# Altium schematic sheet External Memory.SchDoc
size 431 x 279 mm; Organization: ORGANIZATION; Address1: 207; Address2: 13399 104 Ave; Address3: Surrey BC, V3T 0C9; Address4: Canada; Revision: V0.0.0; SheetNumber: 3; SheetTotal: 5; ENG_APP_DATE: --/--/--; DSN_APP_DATE: --/--/--; CHK_APP_DATE: --/--/--
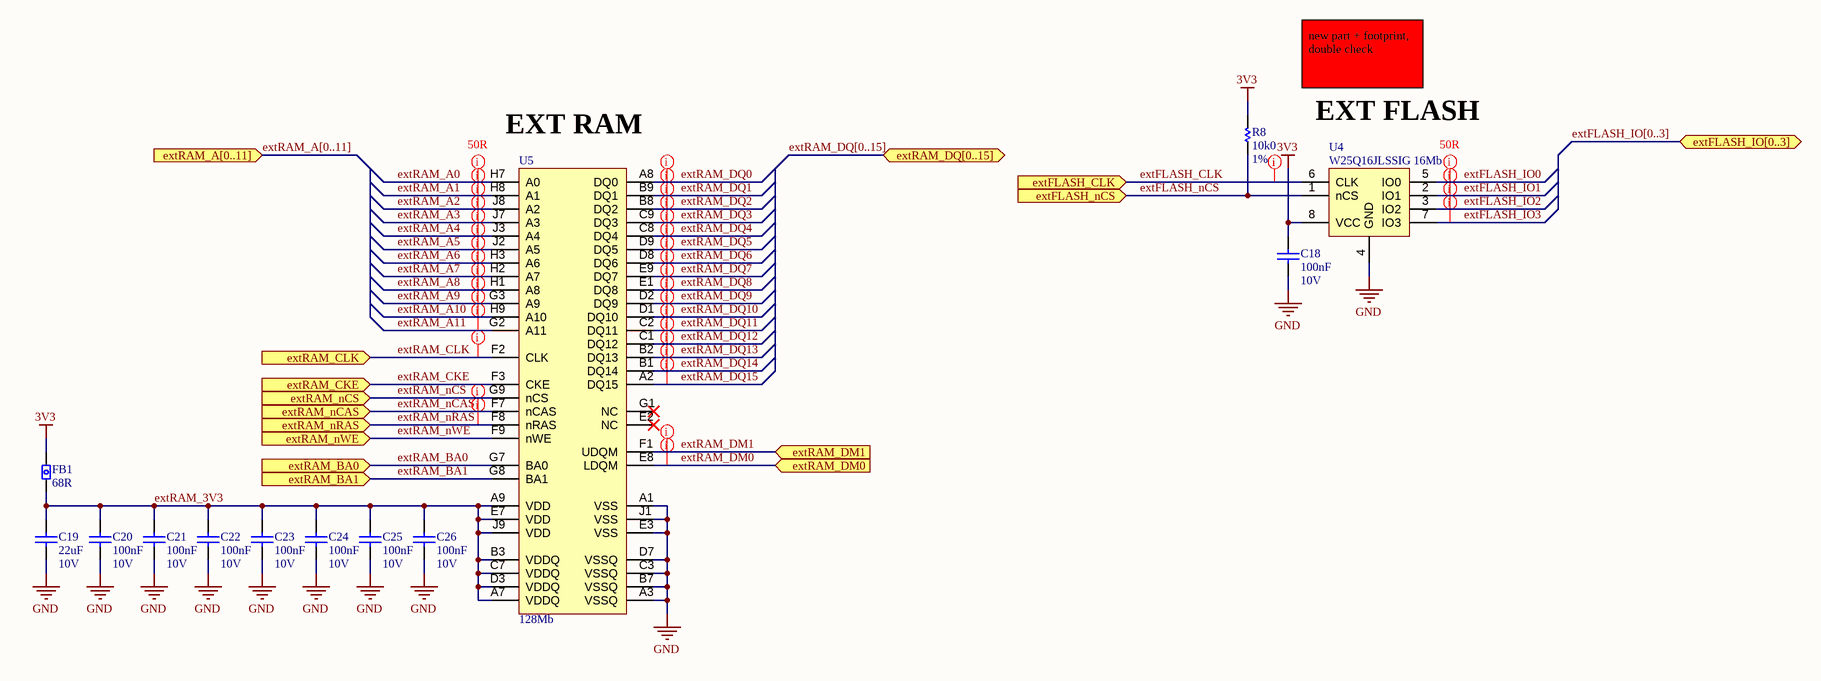
[diagram p0: External Memory.SchDoc]

## Parts
C18  100nF  Voltage Rating: 10V  [C0201]
C19  22uF  Voltage Rating: 10V  [c0603]
C20  100nF  Voltage Rating: 10V  [C0201]
C21  100nF  Voltage Rating: 10V  [C0201]
C22  100nF  Voltage Rating: 10V  [C0201]
C23  100nF  Voltage Rating: 10V  [C0201]
C24  100nF  Voltage Rating: 10V  [C0201]
C25  100nF  Voltage Rating: 10V  [C0201]
C26  100nF  Voltage Rating: 10V  [C0201]
FB1  68R  [FB0402]
R8  10k0  Tolerance: 1%  [r0402]
U4  W25Q16JLSSIG 16Mb  [SOC8W 7.9x5.3mm]
U5  128Mb  [TFBGA54 8x8 SDRAM]

## Ports
extFLASH_CLK (in), extFLASH_IO[0..3] (bidir), extFLASH_nCS (in), extRAM_A[0..11] (in), extRAM_BA0 (in), extRAM_BA1 (in), extRAM_CKE (in), extRAM_CLK (in), extRAM_DM0 (in), extRAM_DM1 (in), extRAM_DQ[0..15] (bidir), extRAM_nCAS (in), extRAM_nCS (in), extRAM_nRAS (in), extRAM_nWE (in)

## Nets
3V3: C18.2 FB1.2 R8.2 U4.8(VCC)
GND: C18.1 C19.1 C20.1 C21.1 C22.1 C23.1 C24.1 C25.1 C26.1 U4.4(GND) U5.A1(VSS) U5.A3(VSSQ) U5.B7(VSSQ) U5.C3(VSSQ) U5.D7(VSSQ) U5.E3(VSS) U5.J1(VSS)
extFLASH_CLK: U4.6(CLK) ; port extFLASH_CLK
extFLASH_IO0: U4.5(IO0)
extFLASH_IO1: U4.2(IO1)
extFLASH_IO2: U4.3(IO2)
extFLASH_IO3: U4.7(IO3)
extFLASH_nCS: R8.1 U4.1(nCS) ; port extFLASH_nCS
extRAM_3V3: C19.2 C20.2 C21.2 C22.2 C23.2 C24.2 C25.2 C26.2 FB1.1 U5.A7(VDDQ) U5.A9(VDD) U5.B3(VDDQ) U5.C7(VDDQ) U5.D3(VDDQ) U5.E7(VDD) U5.J9(VDD)
extRAM_A0: U5.H7(A0)
extRAM_A1: U5.H8(A1)
extRAM_A2: U5.J8(A2)
extRAM_A3: U5.J7(A3)
extRAM_A4: U5.J3(A4)
extRAM_A5: U5.J2(A5)
extRAM_A6: U5.H3(A6)
extRAM_A7: U5.H2(A7)
extRAM_A8: U5.H1(A8)
extRAM_A9: U5.G3(A9)
extRAM_A10: U5.H9(A10)
extRAM_A11: U5.G2(A11)
extRAM_BA0: U5.G7(BA0) ; port extRAM_BA0
extRAM_BA1: U5.G8(BA1) ; port extRAM_BA1
extRAM_CKE: U5.F3(CKE) ; port extRAM_CKE
extRAM_CLK: U5.F2(CLK) ; port extRAM_CLK
extRAM_DM0: U5.E8(LDQM) ; port extRAM_DM0
extRAM_DM1: U5.F1(UDQM) ; port extRAM_DM1
extRAM_DQ0: U5.A8(DQ0)
extRAM_DQ1: U5.B9(DQ1)
extRAM_DQ2: U5.B8(DQ2)
extRAM_DQ3: U5.C9(DQ3)
extRAM_DQ4: U5.C8(DQ4)
extRAM_DQ5: U5.D9(DQ5)
extRAM_DQ6: U5.D8(DQ6)
extRAM_DQ7: U5.E9(DQ7)
extRAM_DQ8: U5.E1(DQ8)
extRAM_DQ9: U5.D2(DQ9)
extRAM_DQ10: U5.D1(DQ10)
extRAM_DQ11: U5.C2(DQ11)
extRAM_DQ12: U5.C1(DQ12)
extRAM_DQ13: U5.B2(DQ13)
extRAM_DQ14: U5.B1(DQ14)
extRAM_DQ15: U5.A2(DQ15)
extRAM_nCAS: U5.F7(nCAS) ; port extRAM_nCAS
extRAM_nCS: U5.G9(nCS) ; port extRAM_nCS
extRAM_nRAS: U5.F8(nRAS) ; port extRAM_nRAS
extRAM_nWE: U5.F9(nWE) ; port extRAM_nWE

Not connected (* = marked no-connect by the designer): U5 E2(NC)* G1(NC)*

## Buses and harness runs
bus extFLASH_IO[0..3] = port extFLASH_IO[0..3]
bus extRAM_A[0..11] = port extRAM_A[0..11]
bus extRAM_DQ[0..15] = port extRAM_DQ[0..15]

## Layout directives
net class 50R extRAM; rule Impedance Constraint [Min = 42.50    Max = 57.50    ]; rule Matched Net Lengths [Tolerance = 250mil]: extRAM_A0, extRAM_A1, extRAM_A2, extRAM_A3, extRAM_A4, extRAM_A5, extRAM_A6, extRAM_A7, extRAM_A8, extRAM_A9, extRAM_A10, extRAM_A11, extRAM_DM0, extRAM_DM1, extRAM_nCAS, extRAM_nRAS
net class 50R extRAM; rule Impedance Constraint [Min = 42.50    Max = 57.50    ]; rule Matched Net Lengths [Tolerance = 250mil]; rule Parallel Segment Constraint [Gap = 20mil    Limit = 1mil    Layer - Same Layer]: extRAM_CLK
net class 50R extRAM data; rule Impedance Constraint [Min = 42.50    Max = 57.50    ]; rule Matched Net Lengths [Tolerance = 250mil]: extRAM_DQ0, extRAM_DQ1, extRAM_DQ2, extRAM_DQ3, extRAM_DQ4, extRAM_DQ5, extRAM_DQ6, extRAM_DQ7, extRAM_DQ8, extRAM_DQ9, extRAM_DQ10, extRAM_DQ11, extRAM_DQ12, extRAM_DQ13, extRAM_DQ14, extRAM_DQ15
net class 50R extFLASH; rule Impedance Constraint [Min = 42.50    Max = 57.50    ]; rule Matched Net Lengths [Tolerance = 100mil]: extFLASH_IO0, extFLASH_IO1, extFLASH_IO2, extFLASH_IO3
net class 50R extFLASH; rule Impedance Constraint [Min = 42.50    Max = 57.50    ]; rule Matched Net Lengths [Tolerance = 100mil]; rule Parallel Segment Constraint [Gap = 20mil    Limit = 1mil    Layer - Same Layer]: extFLASH_CLK

## Notes on the sheet
- new part + footprint, double check
- (near U5) EXT RAM
- EXT FLASH
- REV:
- PROJECT:
- DATE:
- TITLE
- SHEET
- OF
- DESIGNED:
- REVIEWED:

## Library data of the parts
C18 C20-C26 = CAP CER 100nF 10V X5R 0201: CAP CER 0.1UF 10V X5R 0201; Manufacturer 1: Murata; Manufacturer Part Number 1: GRM033R61A104ME15D; Tolerance: 20%; Category 1: Ceramic Capacitors; Supplier 1: Newark; Stock 1: 345000; Pricing 1: 1=0.00300, 15000=0.00300 (USD); Case/Package: 0201; Case Code (Metric): 0603; Case Code (Imperial): 0201; Min Operating Temperature: -55°C; Max Operating Temperature: 85°C; Dielectric: X5R; Packaging: Tape and Reel; Package Quantity: 10; Series: GRM; Voltage Rating (DC): 10V; Length: 0.024inch; Width: 0.012inch; Thickness: 0.013inch; Depth: 0.3mm; Lead Free: Lead Free; ComponentLink1URL: https://datasheet.ciiva.com/131/partnumbering-e-01-131478.pdf?src-supplier=Digi-Key; ComponentLink1Description: https://datasheet.ciiva.com/131/partnumbering-e-01-131478.pdf?src-supplier=Digi-Key; ComponentLink2URL: https://datasheet.ciiva.com/131/partnumbering-e-01-131479.pdf?src-supplier=Digi-Key; ComponentLink2Description: https://datasheet.ciiva.com/131/partnumbering-e-01-131479.pdf?src-supplier=Digi-Key; Supplier Part Number 1: 65AH6960; RoHS 1: Yes; Description 1: CAP CER 0.1UF 10V X5R 0201; Mounting Technology: Surface Mount; Value: 100nF; RoHS Compliant: Yes
C19 = CAP CER 22uF 10V X5R 0603: 0603 22 uF 10 V ±20% Tolerance X5R Multilayer Ceramic Chip Capacitor; Manufacturer: Murata; Manufacturer Part Number: GRM188R61A226ME15D; Supplier 1: Newark; RoHS: Yes; Category: Ceramic Capacitors; Stock 1: 3156000; Pricing 1: 1=0.04900, 4000=0.04700, 8000=0.04400, 16000=0.04300, 24000=0.04200 (USD); Mount: Surface Mount; Case/Package: 0603; Case Code (Metric): 1608; Case Code (Imperial): 0603; Material: Ceramic; Weight: 0.000222oz; Min Operating Temperature: -55°C; Max Operating Temperature: 85°C; Capacitance: 22uF; Tolerance: 20%; Packaging: Cut Tape; Dielectric: X5R; Termination: SMD/SMT; Voltage Rating (DC): 10V; Package Quantity: 4000; Series: GRM; Length: 1.6mm; Width: 0.8mm; Height: 0.8mm; Thickness: 0.039inch; Depth: 0.8mm; Reach SVHC Compliant: Yes; Lead Free: Lead Free; RoHS Compliant: Yes; ComponentLink1URL: https://datasheet.ciiva.com/46444/1769893-46444975.pdf?src-supplier=Element14; ComponentLink1Description: https://datasheet.ciiva.com/46444/1769893-46444975.pdf?src-supplier=Element14; Supplier Part Number 1: 03AC2659
FB1 = FB 68R 400mA 310mR 0402: Ferrite Beads Multi-Layer 68Ohm 25% 100MHz 400mA 310mOhm DCR 0402 T/R; Manufacturer: Taiyo Yuden; Manufacturer Part Number: BK1005LL680-T; DC Resistance (DCR): 310mR; Number of Lines: 1; Shielding: Unshielded; Supplier 1: Digi-Key; RoHS: Yes; Category: Ferrite Beads and Chips; Stock 1: 9707; Pricing 1: 1=0.10000, 10=0.04100, 25=0.03640, 50=0.03300, 100=0.02970, 250=0.02176, 500=0.01584, 1000=0.01551, 5000=0.01056 (USD); Mount: Surface Mount; Case/Package: 0402; Number of Pins: 2; Case Code (Metric): 1005; Case Code (Imperial): 0402; Core Material: Ferrite; Min Operating Temperature: -55°C; Max Operating Temperature: 125°C; Packaging: Tape and Reel; Package Quantity: 1; Impedance: 68R; Tolerance: 25%; Max DC Current: 400mA; Termination: SMD/SMT; Test Frequency: 100MHz; Max Current Rating: 400mA; Series: BK; Frequency: 100MHz; Length: 0.039inch; Width: 0.02inch; Height: 0.022inch; Depth: 0.55mm; Halogen Free: Halogen Free; Lead Free: Lead Free; REACH SVHC: Unknown; ComponentLink1URL: https://datasheet.ciiva.com/1013/bk1005ll680-t-ss-1013936.pdf?src-supplier=Digi-Key; ComponentLink1Description: https://datasheet.ciiva.com/1013/bk1005ll680-t-ss-1013936.pdf?src-supplier=Digi-Key; ComponentLink2URL: https://datasheet.ciiva.com/1013/mlci07-e-1013935.pdf?src-supplier=Digi-Key; ComponentLink2Description: https://datasheet.ciiva.com/1013/mlci07-e-1013935.pdf?src-supplier=Digi-Key; ComponentLink3URL: https://datasheet.ciiva.com/1013/mlci07-e-1013937.pdf?src-supplier=Digi-Key; ComponentLink3Description: https://datasheet.ciiva.com/1013/mlci07-e-1013937.pdf?src-supplier=Digi-Key; Supplier Part Number 1: 587-1860-1-ND
R8 = RES 10k0 1% 63mW 0402: Res General Purpose Thick Film 0402 10K Ohm 1% 1/16W ±100ppm/°C Molded SMD Paper T/R; Manufacturer: Yageo; Manufacturer Part Number: RC0402FR-0710KL; Resistance: 10kR; Voltage Rating (DC): 50V; Power Rating: 62.5mW; Max Power Dissipation: 63mW; Supplier 1: RSComponents; RoHS: Yes; Category: Chip SMD Resistors; Stock 1: 29900; Pricing 1: 10000=0.00300 (GBP); Case/Package: 0402; Number of Pins: 2; Case Code (Imperial): 0402; Case Code (Metric): 1005; Min Operating Temperature: -55°C; Max Operating Temperature: 155°C; Resistor Type: Thick Film; Temperature Coefficient: 100ppm/°C; Packaging: Tape and Reel; Voltage Rating: 50V; Termination: SMD/SMT; Working Voltage: 50V; Number of Terminations: 2; Features: Moisture Resistant; Series: RC; Resistance Tolerance: 1%; Construction: Rectangular; Length: 1mm; Width: 0.5mm; Height: 0.32mm; Depth: 0.5mm; Lead Pitch: 0.2mm; REACH SVHC: No SVHC; Lead Free: Lead Free; RoHS Compliant: Yes; Military Standard: Not; ComponentLink1URL: https://datasheet.ciiva.com/7660/38568-7660787.pdf?src-supplier=Element14; ComponentLink1Description: https://datasheet.ciiva.com/7660/38568-7660787.pdf?src-supplier=Element14; ComponentLink2URL: https://datasheet.ciiva.com/12667/pyu-rc0402-51-rohs-l-6-r-12667067.pdf?src-supplier=Mouser; ComponentLink2Description: https://datasheet.ciiva.com/12667/pyu-rc0402-51-rohs-l-6-r-12667067.pdf?src-supplier=Mouser; ComponentLink3URL: https://datasheet.ciiva.com/7849/1784430-7849813.pdf?src-supplier=Element14; ComponentLink3Description: https://datasheet.ciiva.com/7849/1784430-7849813.pdf?src-supplier=Element14; ComponentLink4URL: https://datasheet.ciiva.com/7849/1686128-7849814.pdf?src-supplier=Element14; ComponentLink4Description: https://datasheet.ciiva.com/7849/1686128-7849814.pdf?src-supplier=Element14; ComponentLink5URL: https://datasheet.ciiva.com/7849/1784430-7849815.pdf?src-supplier=Element14; ComponentLink5Description: https://datasheet.ciiva.com/7849/1784430-7849815.pdf?src-supplier=Element14; ComponentLink6URL: https://datasheet.ciiva.com/7983/1018594-7983486.pdf?src-supplier=Element14; ComponentLink6Description: https://datasheet.ciiva.com/7983/1018594-7983486.pdf?src-supplier=Element14; ComponentLink7URL: https://datasheet.ciiva.com/22747/1018594-22747512.pdf?src-supplier=Element14; ComponentLink7Description: https://datasheet.ciiva.com/22747/1018594-22747512.pdf?src-supplier=Element14; Supplier Part Number 1: 1987643
U4 = IC FLASH QSPI 16Mb W25Q16JLSSIG: NOR Flash Serial (SPI, Dual SPI, Quad SPI) 2.5V/3.3V 16M-bit 2M x 8 6ns 8-Pin SOIC Tube; Manufacturer: Winbond; Supplier 1: Digi-Key; Manufacturer Part Number: W25Q16JLSSIG; RoHS: Yes; Category: Memory; Stock 1: 5181; Pricing 1: 1=0.57000, 10=0.56100, 25=0.52120, 50=0.51820, 100=0.46020, 250=0.45436, 500=0.44748, 1000=0.43553, 5000=0.39152 (USD); RoHS Compliant: Yes; Supplier Part Number 1: 256-W25Q16JLSSIG-ND
U5 = IC MEM SDRAM 128MB 54BGA AS4C8M16SA-6BINTR: SDR 128Mb 8M x 16 3.3V 54ball BGA 166 Mhz Tape and Reel; Manufacturer: Alliance Memory; Supplier 1: Digi-Key; Manufacturer Part Number: AS4C8M16SA-6BINTR; RoHS: Yes; Category: Memory; Stock 1: 65992; Pricing 1: 1=5.51000, 10=5.03200, 25=4.93640, 50=4.90040, 100=4.39720, 250=4.38076, 500=4.10576, 1000=3.93250 (USD); ComponentLink1URL: http://www.mouser.com/ds/2/12/128M-AS4C8M16SA-607392.pdf?src-supplier=Mouser; ComponentLink1Description: http://www.mouser.com/ds/2/12/128M-AS4C8M16SA-607392.pdf?src-supplier=Mouser; Supplier Part Number 1: 1450-AS4C8M16SA-6BINCT-ND